# EAGLE design GBA_EMU (EAGLE 7.7.0)
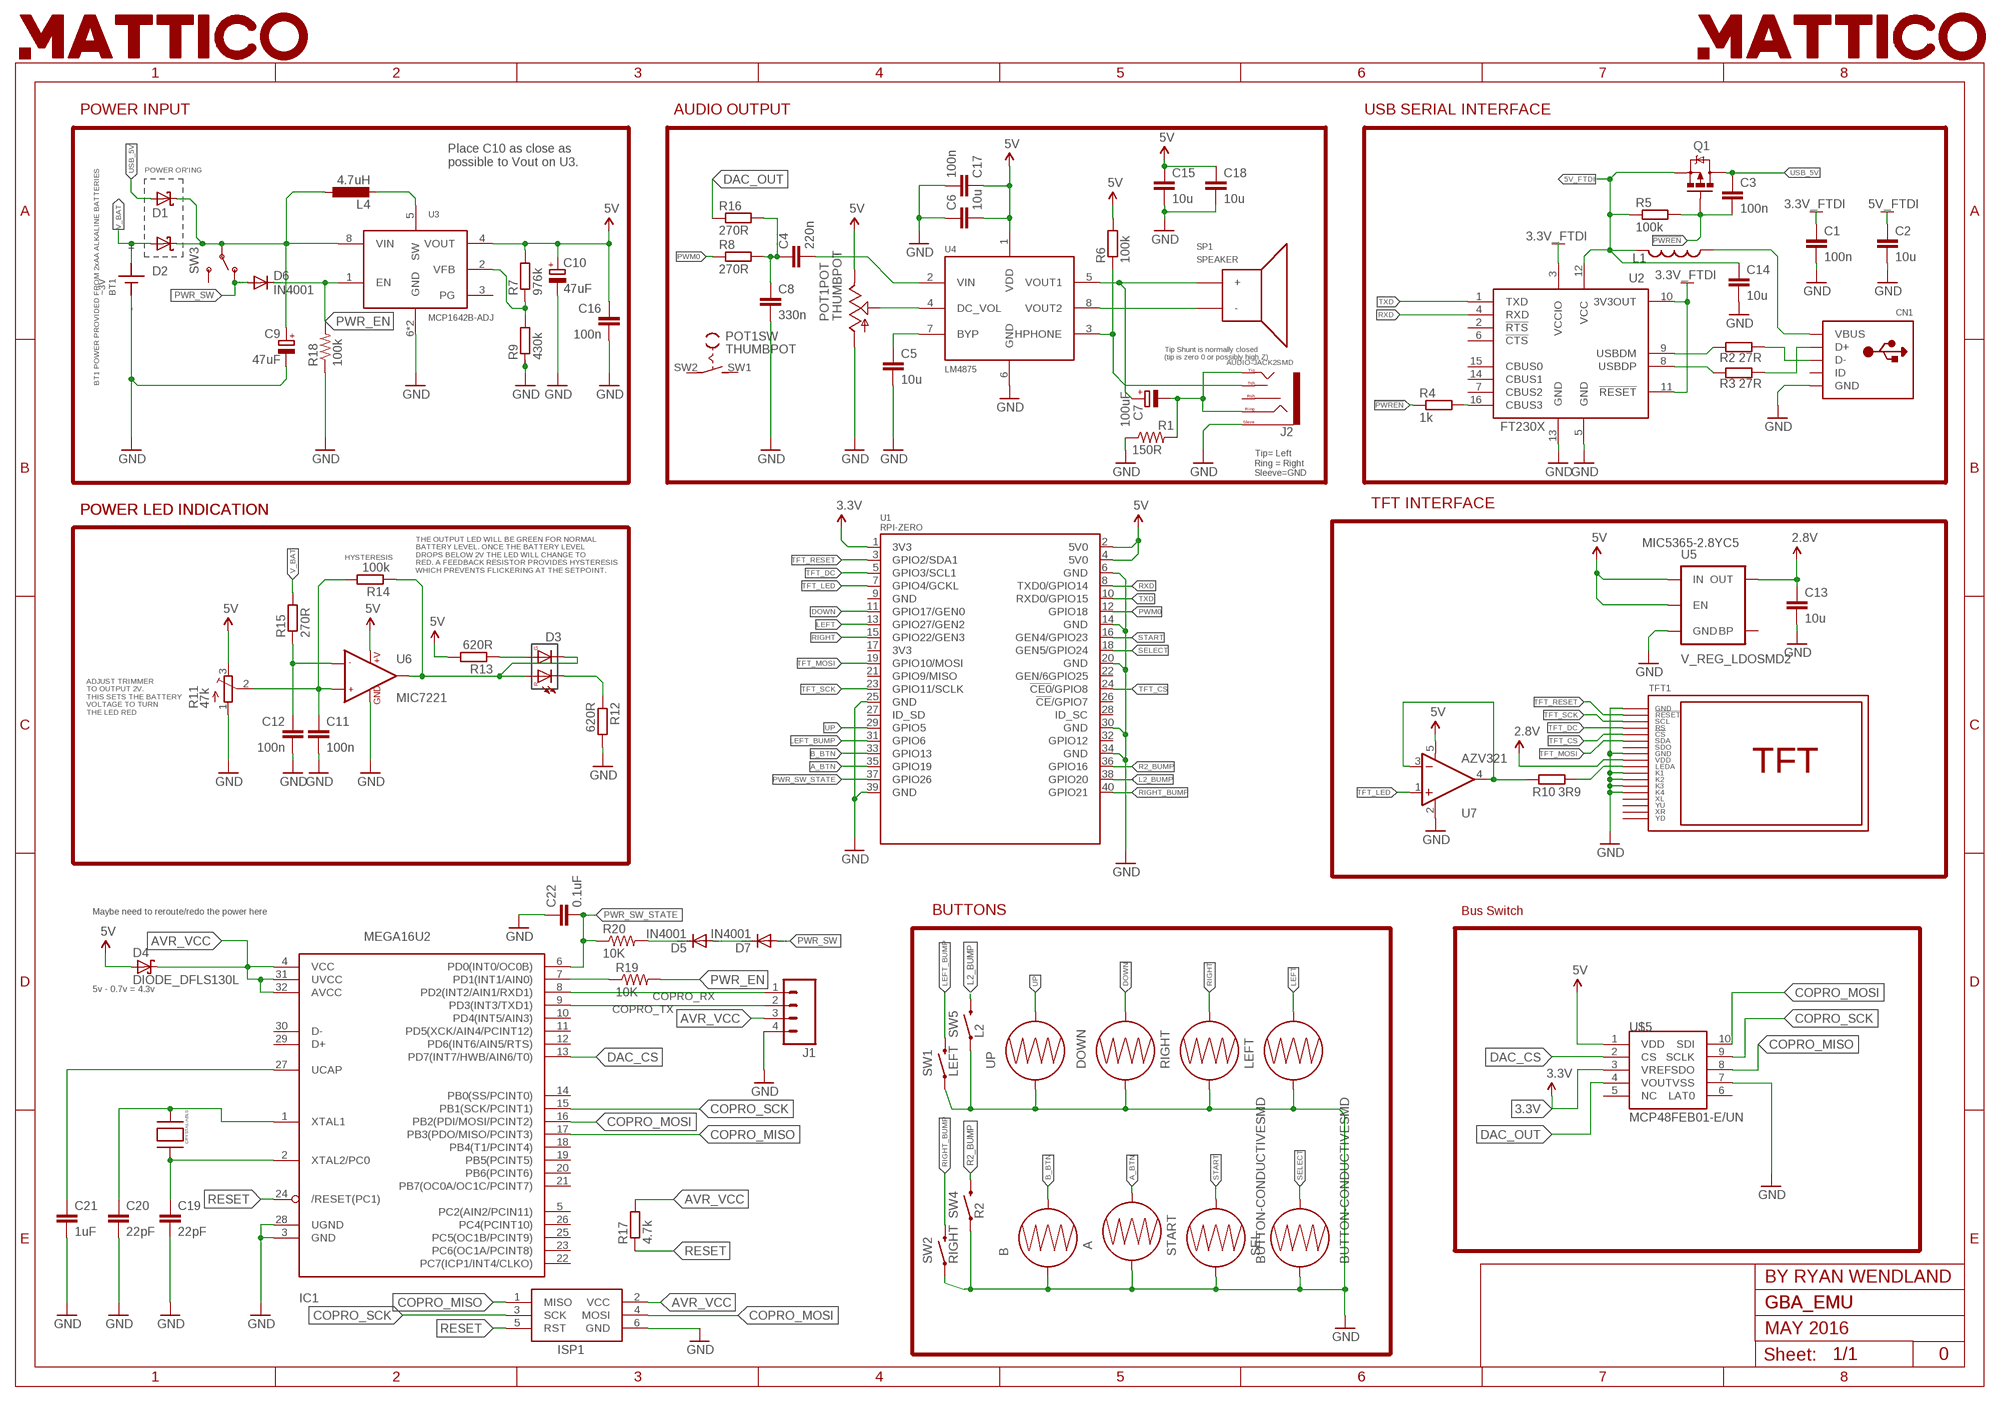
[diagram p0: schematic, sheet 1]

## Parts
A  GBA_BTN_CONDUCTIVE  [GBA_BUTTON_CONDUCTIVE]
B  GBA_BTN_CONDUCTIVE  [GBA_BUTTON_CONDUCTIVE]
BT1  ~3V  BATTERY  [BATTERY]
C1  100n  C-EUC0805  [C0805]
C2  10u  C-EUC0805  [C0805]
C3  100n  C-EUC0805  [C0805]
C4  220n  C-EUC0805  [C0805]
C5  10u  C-EUC0805  [C0805]
C6  10u  C-EUC0805  [C0805]
C7  100uF  CPOL-EU153CLV-0405  [153CLV-0405]
C8  330n  C-EUC0805  [C0805]
C9  47uF  CPOL-EU153CLV-0405  [153CLV-0405]
C10  47uF  CPOL-EU153CLV-0405  [153CLV-0405]
C11  100n  C-EUC0805  [C0805]
C12  100n  C-EUC0805  [C0805]
C13  10u  C-EUC0805  [C0805]
C14  10u  C-EUC0805  [C0805]
C15  10u  C-EUC0805  [C0805]
C16  100n  C-EUC0805  [C0805]
C17  100n  C-EUC0805  [C0805]
C18  10u  C-EUC0805  [C0805]
C19  22pF  22PF-50V-5%(0603)  [0603-CAP]
C20  22pF  22PF-50V-5%(0603)  [0603-CAP]
C21  1uF  1UF-25V-10%(0805)"  [0805-CAP]
C22  0.1uF  0.1UF-25V(+80/-20%)(0603)  [0603-CAP]
CN1  USBMINIB  [USB-MINIB]
D1  DFLS130L  [POWERDI_123]
D2  DFLS130L  [POWERDI_123]
D3  DUAL_LED  [DUAL_LED]
D4  DIODE_DFLS130L  [DIODE_POWERDI_123]
D5  IN4001  CGRM4001-G  [SOD-123_MINI-SMA]
D6  IN4001  CGRM4001-G  [SOD-123_MINI-SMA]
D7  IN4001  CGRM4001-G  [SOD-123_MINI-SMA]
DOWN  GBA_BTN_CONDUCTIVE  [GBA_BUTTON_CONDUCTIVE]
IC1  MEGA16U2  ATMEGA32U2-TQFP  [TQFP32-08]
ISP1  AVRISP-6  [AVRISP]
J1  M041.27MM  [1X04-1.27MM]
J2  AUDIO-JACK2SMD  [AUDIO-JACK-3.5MM-SMD]
L1  600  INDUCTOR0805  [0805]
L4  4.7uH  L-EUWE-TPC  [POWER-CHOKE_WE-TPC]
LEFT  GBA_BTN_CONDUCTIVE  [GBA_BUTTON_CONDUCTIVE]
POT1  THUMBPOT  [THUMBWHEEL]
Q1  MOSFET-PCHANNEL  [SOT23-3]
R1  150R  47KOHM1/10W1%(0603)  [0603-RES]
R2  27R  R-EU_R0805  [R0805]
R3  27R  R-EU_R0805  [R0805]
R4  1k  R-EU_R0805  [R0805]
R5  100k  R-EU_R0805  [R0805]
R6  100k  R-EU_R0805  [R0805]
R7  976k  R-EU_R0805  [R0805]
R8  270R  R-EU_R0805  [R0805]
R9  430k  R-EU_R0805  [R0805]
R10  3R9  R-EU_R0805  [R0805]
R11  47k  TRIMPOTTC33X  [TC33X]
R12  620R  R-EU_R0805  [R0805]
R13  620R  R-EU_R0805  [R0805]
R14  100k  R-EU_R0805  [R0805]
R15  270R  R-EU_R0805  [R0805]
R16  270R  R-EU_R0805  [R0805]
R17  4.7k  R-EU_R0805  [R0805]
R18  100k  100KOHM-1/10W-1%(0603)  [0603-RES]
R19  10K  10KOHM-1/10W-1%(0603)0603  [0603-RES]
R20  10K  10KOHM-1/10W-1%(0603)0603  [0603-RES]
RIGHT  GBA_BTN_CONDUCTIVE  [GBA_BUTTON_CONDUCTIVE]
SEL  BUTTON-CONDUCTIVESMD  [BUTTON-CONDUCTIVE]
SP1  SPEAKER  [SPEAKER]
START  BUTTON-CONDUCTIVESMD  [BUTTON-CONDUCTIVE]
SW1  LEFT  BUTTON  [BUMPER]
SW2  RIGHT  BUTTON  [BUMPER]
SW3  GBA_PWR_SWITCHCSS_1310TB  [PWR_SWITCH_CSS_1310TB]
SW4  R2  GBA_BUTTONNOHOLE  [BUMPER_NOHOLE]
SW5  L2  GBA_BUTTONNOHOLE  [BUMPER_NOHOLE]
TFT1  GBA_TFT  [GBA_TFT]
U1  RPI-ZERO  [RASPBERRYPI_BASTELSTUBE_V13_RASPI_BOARD_B+_FULL]
U2  FT230X  [SSOP16]
U3  MCP1642B-ADJ  [MSOP8]
U4  LM4875  [SOIC8]
U5  V_REG_LDOSMD2  [SC70]
U6  MIC7221  [SOT23-5]
U7  AZV321  [SOT23-5]
U$1  LOGO2INCH_SVG  [LOGO_2INCH_SVG]
U$2  LOGO2INCH_SVG  [LOGO_2INCH_SVG]
U$3  CRYSTAL-ABLS  [HC49/US]
U$5  MCP48FEB01-E/UN  [10-MSOP]
UP  GBA_BTN_CONDUCTIVE  [GBA_BUTTON_CONDUCTIVE]

## Nets
0.8128: C9.+ D1.2(C) D2.2(C) L4.1 SW3.P$3(P) U3.8(VIN)
2.8V: C13.1 TFT1.9(VDD) U5.5(OUT)
3.3V: U1.1(3V3) U$5.3(VREF)
3.3V_FTDI: C1.1 U2.3(VCCIO) U2.10(3V3OUT) U2.11(!RESET)
5V: C6.2 C10.+ C15.1 C16.1 C17.1 C18.1 D4.1(A) POT1.3(POT:E) R6.2 R7.2 R11.3(E) R13.2 U1.2(5V0) U1.4(5V0) U3.4(VOUT) U4.1(VDD) U5.1(IN) U5.3(EN) U6.2(+V) U7.5(V+) U$5.1(VDD)
5V_FTDI: C2.1 C14.1 L1.1 Q1.2(S) R5.1 U2.12(VCC)
!PWREN: C3.2 Q1.1(G) R4.1 R5.2
A_BTN: A.2 U1.35(GPIO19)
AVR_VCC: D4.2(C) IC1.4(VCC) IC1.31(UVCC) IC1.32(AVCC) ISP1.2(VCC) J1.3 R17.2
B_BTN: B.2 U1.33(GPIO13)
COPRO_MISO: IC1.17(PB3(PDO/MISO/PCINT3)) ISP1.1(MISO) U$5.8(SDO)
COPRO_MOSI: IC1.16(PB2(PDI/MOSI/PCINT2)) ISP1.4(MOSI) U$5.10(SDI)
COPRO_RX: IC1.8(PD2(INT2/AIN1/RXD1)) J1.1
COPRO_SCK: IC1.15(PB1(SCK/PCINT1)) ISP1.3(SCK) U$5.9(SCLK)
COPRO_TX: IC1.9(PD3(INT3/TXD1)) J1.2
DAC_CS: IC1.13(PD7(INT7/HWB/AIN6/T0)) U$5.2(CS)
DAC_OUT: R16.1 U$5.4(VOUT)
DOWN: DOWN.2 U1.11(GPIO17/GEN0)
GND: A.1 B.1 BT1.BT-1(-) BT1.BT-2(-) C1.2 C2.2 C5.2 C6.1 C8.2 C9.- C10.- C11.2 C12.2 C13.2 C14.2 C15.2 C16.2 C17.2 C18.2 C19.2 C20.2 C21.2 C22.1 CN1.GND DOWN.1 IC1.3(GND) IC1.28(UGND) ISP1.6(GND) J1.4 J2.SLEEVE LEFT.1 POT1.1(POT:A) R1.1 R9.1 R11.1(A) R12.2 R18.1 RIGHT.1 SEL.1 START.1 SW1.1 SW2.1 SW4.1 SW5.1 TFT1.1(GND) TFT1.8(GND) TFT1.11(K1) TFT1.12(K2) TFT1.13(K3) TFT1.14(K4) U1.6(GND) U1.14(GND) U1.20(GND) U1.25(GND) U1.30(GND) U1.34(GND) U1.39(GND) U2.5(GND) U2.13(GND) U3.6(GND) U3.7(GND) U4.6(GND) U5.2(GND) U6.5(GND) U7.2(V-) U$5.7(VSS) UP.1
L2_BUMP: SW5.2 U1.38(GPIO20)
LEFT: LEFT.2 U1.13(GPIO27/GEN2)
LEFT_BUMP: SW1.2 U1.31(GPIO6)
N$1: C11.1 R11.2(S) R14.2 U6.3(+IN1)
N$2: C4.1 C8.1 R8.2 R16.2
N$3: CN1.VBUS L1.2
N$4: CN1.D- R2.2
N$5: CN1.D+ R3.2
N$6: R2.1 U2.9(USBDM)
N$7: R3.1 U2.8(USBDP)
N$8: POT1.2(POT:S) U4.4(DC_VOL)
N$9: C4.2 U4.2(VIN)
N$10: R4.2 U2.16(CBUS3)
N$11: C5.1 U4.7(BYP)
N$12: L4.2 U3.5(SW)
N$13: D5.A D7.C
N$14: C7.+ SP1.1(+) U4.5(VOUT1)
N$15: SP1.2(-) U4.8(VOUT2)
N$16: J2.TSH R6.1 U4.3(HPHONE)
N$17: C20.1 IC1.1(XTAL1) U$3.P$2
N$18: IC1.7(PD1(INT1/AIN0)) R19.1
N$19: D3.1 D3.3 R14.1 U6.1(OUT1)
N$20: R7.1 R9.2 U3.2(VFB)
N$21: R10.2 TFT1.10(LEDA)
N$22: D3.4 R13.1
N$23: D3.2 R12.1
N$24: R10.1 U7.3(-IN) U7.4(OUT)
N$25: C12.1 R15.1 U6.4(-IN1)
N$26: C19.1 IC1.2(XTAL2/PC0) U$3.P$1
N$28: C21.1 IC1.27(UCAP)
N$29: C7.- J2.RING J2.TIP R1.2
N$31: D5.C R20.2
PWM0: R8.1 U1.12(GPIO18)
PWR_EN: D6.C R18.2 R19.2 U3.1(EN)
PWR_SW: D6.A D7.A SW3.P$1(O)
PWR_SW_STATE: C22.2 IC1.6(PD0(INT0/OC0B)) R20.1 U1.37(GPIO26)
R2_BUMP: SW4.2 U1.36(GPIO16)
RESET: IC1.24(/RESET(PC1)) ISP1.5(RST) R17.1
RIGHT: RIGHT.2 U1.15(GPIO22/GEN3)
RIGHT_BUMP: SW2.2 U1.40(GPIO21)
RXD: U1.8(TXD0/GPIO14) U2.4(RXD)
SELECT: SEL.2 U1.18(GEN5/GPIO24)
START: START.2 U1.16(GEN4/GPIO23)
TFT_CS: TFT1.5(!CS) U1.24(!CE0!/GPIO8)
TFT_DC: TFT1.4(RS) U1.5(GPIO3/SCL1)
TFT_LED: U1.7(GPIO4/GCKL) U7.1(+IN)
TFT_MOSI: TFT1.6(SDA) U1.19(GPIO10/MOSI)
TFT_RESET: TFT1.2(!RESET) U1.3(GPIO2/SDA1)
TFT_SCK: TFT1.3(SCL) U1.23(GPIO11/SCLK)
TXD: U1.10(RXD0/GPIO15) U2.1(TXD)
UP: U1.29(GPIO5) UP.2
USB_5V: C3.1 D1.1(A) Q1.3(D)
V_BAT: BT1.BT+1(+) BT1.BT+2(+) D2.1(A) R15.2
Unconnected: CN1.ID IC1.5(PC2(AIN2/PCIN11)) IC1.10(PD4(INT5/AIN3)) IC1.11(PD5(XCK/AIN4/PCINT12)) IC1.12(PD6(INT6/AIN5/RTS)) IC1.14(PB0(SS/PCINT0)) IC1.18(PB4(T1/PCINT4)) IC1.19(PB5(PCINT5)) IC1.20(PB6(PCINT6)) IC1.21(PB7(OC0A/OC1C/PCINT7)) IC1.22(PC7(ICP1/INT4/CLKO)) IC1.23(PC6(OC1A/PCINT8)) IC1.25(PC5(OC1B/PCINT9)) IC1.26(PC4(PCINT10)) IC1.29(D+) IC1.30(D-) J2.RSH POT1.SW1(SW:S) POT1.SW2(SW:P) SW3.P$4(S) TFT1.7(SDO) TFT1.15(XL) TFT1.16(YU) TFT1.17(XR) TFT1.18(YD) U1.9(GND) U1.17(3V3) U1.21(GPIO9/MISO) U1.22(GEN/6GPIO25) U1.26(!CE!/GPIO7) U1.27(ID_SD) U1.28(ID_SC) U1.32(GPIO12) U2.2(!RTS) U2.6(!CTS) U2.7(CBUS2) U2.14(CBUS1) U2.15(CBUS0) U3.3(PG) U5.4(BP) U$5.5(NC) U$5.6(LAT0)

## Notes on the sheet
- POWER INPUT | AUDIO OUTPUT | USB SERIAL INTERFACE
- Place C10 as close as
  possible to Vout on U3.
- POWER OR'ING
- Tip Shunt is normally closed
  (tip is zero 0 or possibly high Z)
- BT1 POWER PROVIDED FROM 2xAA ALKALINE BATTERIES
- Tip= Left
  Ring = Right
  Sleeve=GND
- TFT INTERFACE
- POWER LED INDICATION | POWER LED INDICATION
- MIC5365-2.8YC5
- HYSTERESIS
- THE OUTPUT LED WILL BE GREEN FOR NORMAL
  BATTERY LEVEL. ONCE THE BATTERY LEVEL
  DROPS BELOW 2V THE LED WILL CHANGE TO
  RED. A FEEDBACK RESISTOR PROVIDES HYSTERESIS
  WHICH PREVENTS FLICKERING AT THE SETPOINT.
- ADJUST TRIMMER
  TO OUTPUT 2V.
  THIS SETS THE BATTERY
  VOLTAGE TO TURN
  THE LED RED
- Maybe need to reroute/redo the power here | BUTTONS | Bus Switch
- 5v - 0.7v = 4.3v
- BY RYAN WENDLAND
- GBA_EMU
- MAY 2016
- 0

## Library data of the parts
A B DOWN LEFT RIGHT UP = GBA:GBA_BTN_CONDUCTIVE
BT1 = GBA:BATTERY
C1-C6 C8 C11-C18 = rcl:C-EU: CAPACITOR, European symbol
C7 C9 C10 = rcl:CPOL-EU: POLARIZED CAPACITOR, European symbol
C19 C20 = SparkFun-Capacitors:22PF-50V-5%(0603): CAP-07876; PROD_ID: CAP-07876
C21 = SparkFun-Capacitors:1UF-25V-10%(0805): CAP-08064
C22 = SparkFun-Capacitors:0.1UF-25V(+80/-20%)(0603): CAP-00810 Ceramic Standard decoupling cap; PROD_ID: CAP-00810
CN1 = adafruit:USB: USB Connectors USBMINIB - Surface Mount Female Mini-B USB Connector 4UConnector: 06564 By microbuilder.eu Thru-hole RA Female Mini-B USB Connector 4UConnector: 18732 By ladyada.net
D1 D2 = diode:DFLS130L
D3 = GBA:DUAL_LED
D4 = custom:DIODE_DFLS130L
D5-D7 = diode:CGRM400*-G: Molded plasitc,JEDEC SOD-123/Mini SMA Source: Comchip CGRM4001-G.pdf
IC1 = adafruit:ATMEGA32U2: ATmega32u2 Pin compatible with the atmega8u2, atmega16u2 and atmega32u2 8, 16 or 32 K flash, 1K RAM, 512b EEPROM 8 bit and 16 bit timer (5 PWM total) UART, SPI (no I2C!) USB with 4 endpoints, LUFA compatible 22 I/O lines, analog comparator (no ADC!) Comes with DFU bootloader burned in!
ISP1 = adafruit:AVRISP: AVR ISP HEADER Standard 6 pin header for AVR programming
J1 = SparkFun-Connectors:M04: Header 4 Standard 4-pin 0.1" header. Use with straight break away headers (SKU : PRT-00116), right angle break away headers (PRT-00553), swiss pins (PRT-00743), machine pins (PRT-00117), and female headers (PRT-00115). Molex polarized connector foot print use with SKU : PRT-08231 with associated crimp pins and housings. 1MM SMD Version SKU: PRT-10208
J2 = SparkFun-Connectors:AUDIO-JACK2: Stereo audio jack with bypass switches. SMT version used on LilyPad MP3 board.; PROD_ID: CONN-10353
L1 = SparkFun-Passives:INDUCTOR: Inductors Basic Inductor/Choke - 0603 and 1206. Footprints are not proven and vary greatly between part numbers. INDUCTOR POWER 3.3UH 4.0A SMD 0.197" L x 0.197" W x 0.177" H (5.00mm x 5.00mm x 4.50mm)
L4 = rcl:L-EU: INDUCTOR, European symbol
POT1 = adafruit:THUMBPOT: Thumbwheel pot with switch Available in horizontal (Alpha RV121SF) or vertical (Xicon 311-1701)
Q1 = SparkFun-DiscreteSemi:MOSFET-PCHANNEL: Generic PMOSFET IRLML2244 - TRANS-11153 (SOT-23 -20V -4.3A) (1.Gate 2.Source 3.Drain) FQP27P06 - COM-10349 <http://www.sparkfun.com/products/10349> (TO-220 -60V -27A) (1.Gate 2.Source 3.Drain); PROD_ID: TRANS-08285
R1 = SparkFun-Resistors:47KOHM1/10W1%(0603): RES-07871; PROD_ID: RES-07871; VALUE: 47K
R2-R10 R12-R17 = rcl:R-EU_: RESISTOR, European symbol
R11 = adafruit:TRIMPOT: SMT trimmer potentiometer part number TC33X http://www.ladyada.net/library/eagle
R18 = SparkFun-Resistors:100KOHM-1/10W-1%(0603): RES-07828; PROD_ID: RES-07828
R19 R20 = SparkFun-Resistors:10KOHM-1/10W-1%(0603): RES-00824; PROD_ID: RES-00824
SEL START = SparkFun-Electromechanical:BUTTON-CONDUCTIVE: Used with rubber key pads. This one was designed and proven to work with the PolyCase Key FOB enclosures.
SP1 = GBA:SPEAKER
SW1 SW2 = GBA:BUTTON
SW3 = custom:GBA_PWR_SWITCH
SW4 SW5 = custom:GBA_BUTTON
TFT1 = GBA:GBA_TFT
U1 = RPI-Zero:RPI-ZERO
U2 = ftdichip:FT230X
U3 = microchip:MCP1642B-ADJ
U4 = texas:LM4875
U5 = SparkFun-PowerIC:V_REG_LDO: Voltage Regulator LDO Standard 150mA LDO voltage regulator in SOT-23 layout. Micrel part MIC5205. BP (by-pass) pin is used to lower output noise with 470pF cap.; PROD_ID: VREG-08428
U6 = SparkFun-AnalogIC:MIC7221
U7 = GBA:AZV321
U$1 U$2 = custom:LOGO
U$3 = custom:CRYSTAL-ABLS: Crystal such as digikey part number 535-13436-1-ND
U$5 = custom:MCP48FEB01-E

## Board
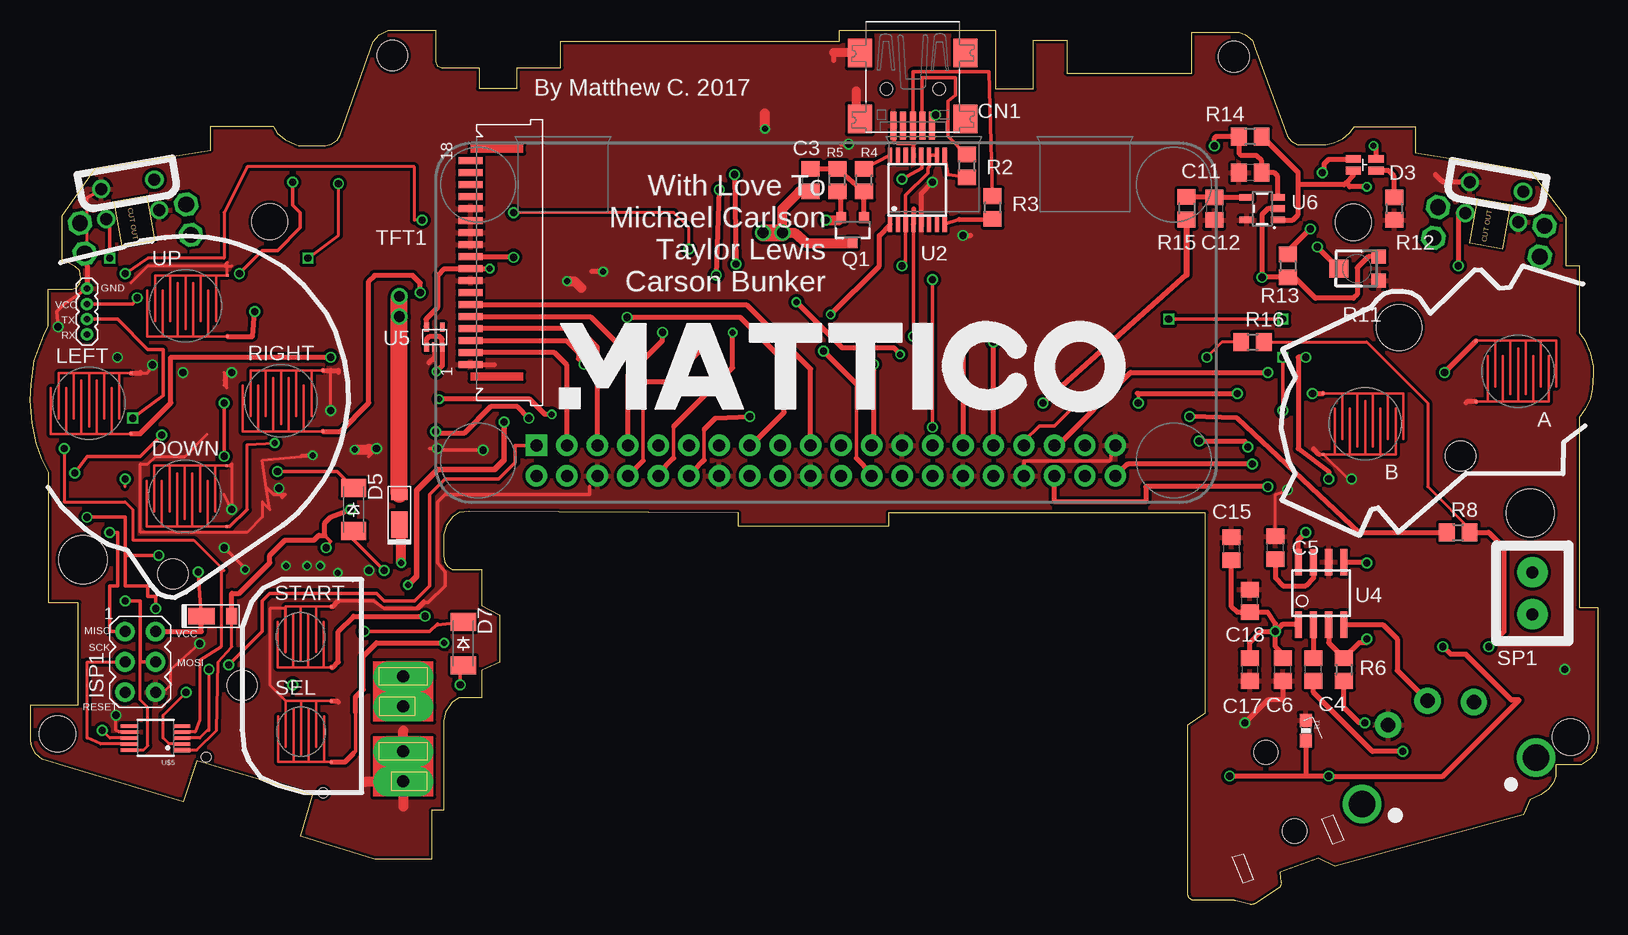
[diagram p1: board, top side]
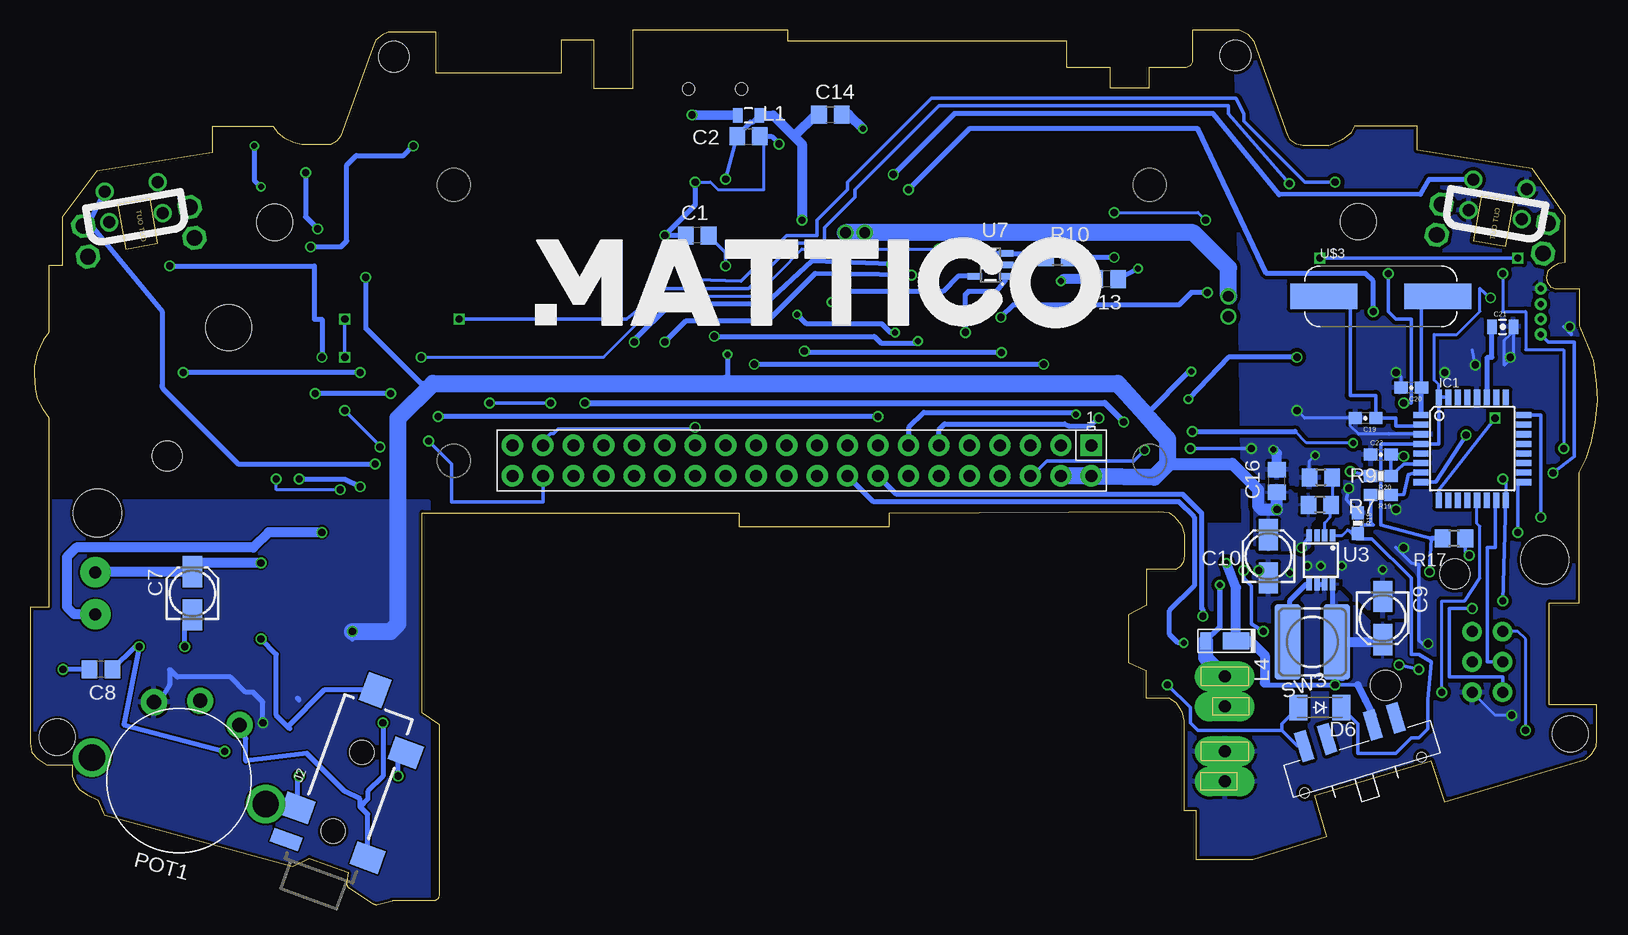
[diagram p2: board, bottom side, seen from below]

Size 130.69 x 72.92 mm. Coordinates in mm from the lower left corner, seen from the top.
Outline: 44.23,72 67.49,72 67.49,72.92 80.47,72.92 80.47,68.02 83.66,68.02 83.66,72.06 86.44,72.06 86.44,69.33 96.85,69.33 96.85,72.72 100.82,72.72 101.3,72.55 101.88,72.06 102.12,71.43 104.81,64.08 105.13,63.65 105.63,63.36 108.03,63.36 108.7,63.53 109.43,63.87 109.99,64.31 110.39,64.87 115.48,64.87 115.48,62.69 125.12,61.16 128,57.31 128,53.27 129.14,53.27 129.14,47.69 129.6,47.09 130.07,45.98 130.33,44.87 130.33,44.25 130.25,43 130.07,42.15 129.64,41.33 129.14,40.6 129.14,24.79 130.69,24.79 130.69,13.46 130.53,12.69 130.04,12.17 129.31,11.66 127.18,11.66 127.18,10.71 126.98,10.16 126.58,9.6 125.93,9.17 125.03,8.75 124.58,7.66 124.5,7.46 108.77,3.2 107.4,3.87 104.17,2.69 104.29,1.85 arc-65 104.06,1.36 102.09,0.08 arc-48 101.69,0.02 100.5,0.33 arc15 100.38,0.34 97.04,0.36 arc-90 96.53,0.86 96.53,14.98 98,15.98 98,32.67 71.58,32.67 71.58,31.52 59.06,31.52 59.06,32.65 36.59,32.78 35.76,32.71 35.27,32.34 34.73,31.65 34.48,30.88 34.48,29.11 34.55,28.57 34.79,28.19 35.17,27.96 37.64,27.96 37.64,24.96 39.13,24.15 39.13,20.18 37.66,19.54 37.66,17.22 35.75,17.22 35.18,16.84 34.65,16.07 34.49,15.31 34.49,7.86 33.49,7.86 33.49,3.79 28.74,3.79 22.58,5.68 23.57,9.1 13.91,11.99 12.78,8.58 1.02,12.09 0.5,12.55 0.14,13.19 0.07,13.63 0.07,16.67 4.04,16.67 4.04,25.16 1.56,25.16 1.56,36.03 0.97,37.18 0.54,38.48 0.19,40.16 0,42.04 0.08,43.4 0.34,45.37 0.72,46.37 1.16,47.43 1.47,48.14 1.51,48.23 1.51,51.3 3.52,51.3 3.89,51.45 4.19,51.84 4.23,52.3 4.14,52.86 3.76,53.2 3.24,53.48 2.71,53.57 2.71,57.43 5.44,61.36 15.06,62.91 15.06,64.9 20.28,64.9 20.6,64.32 21.28,63.8 22.18,63.35 22.4,63.28 24.6,63.28 25.12,63.41 25.61,63.75 25.86,64.14 28.62,71.95 29.12,72.52 29.87,72.91 33.8,72.91 33.8,70.26 33.95,69.93 34.31,69.76 37.44,69.76 37.44,68.06 40.62,68.06 40.62,69.78 44.24,69.78 44.23,72
Copper layers (1*16): Top 0.035mm / dielectric 1.5mm / Bottom 0.035mm
Design rules "Elecrow_2-layer_eagle_rule": minimum track width 6mil, minimum drill 12mil, track to track 6mil, track to pad 6mil, pad to pad 6mil, via to via 6mil, smd to smd 0mil, copper to edge 10mil, drill to drill 10mil, minimum pad ring 10mil, minimum via ring 6mil, stop-mask expansion 2mil, vias tented up to drill 100mil, thermal gap 10mil
Holes 3 mm at 2.29,14.23 19.97,56.94 110.31,56.88 128.41,13.96
Holes 2.54 mm at 30.21,70.79 100.36,70.69
Holes 2.5 mm at 17.7,18.27 11.92,27.56 119.26,37.4
Holes 3.8 mm at 114.13,48.12
Holes 4 mm at 125.06,32.65 4.41,28.76

### Footprints (pad centres in the part's own frame; a part is rotated, then mirrored left to right if it is on the bottom)
GBA_BUTTON_CONDUCTIVE = smd 0.203 x 0.203: 1 3.493,2.54; 2 3.493,-2.54
BATTERY = drill 1 pad 2.5 long: BT+1 0,4.5; BT+2 0,2; BT-1 0,-1.75; BT-2 0,-4.25
C0805 = smd 1.3 x 1.5: 1 -0.95,0; 2 0.95,0
153CLV-0405 = smd 2.6 x 1.6: + 1.8,0; - -1.8,0
0603-CAP = smd 1.1 x 1: 1 -0.85,0; 2 0.85,0
0805-CAP = smd 0.8 x 1.2: 1 -0.9,0; 2 0.9,0
USB-MINIB = smd 0.5 x 2.308: D+ 0,4.064; D- -0.8,4.064; GND 1.6,4.064; ID 0.8,4.064; VBUS -1.6,4.064 | smd 2 x 2.4: GND1 -4.4,-2; GND2 -4.4,3.5; GND3 4.4,3.5; GND4 4.4,-2 | hole 1: -2.2,1; 2.2,1
POWERDI_123 = smd 0.9 x 1.4: 1 2.54,0 | smd 2.2 x 1.4: 2 0,0
DUAL_LED = smd 1.27 x 0.635: 1 0.953,0.492; 2 -0.953,0.492; 3 -0.953,-0.492; 4 0.953,-0.492
DIODE_POWERDI_123 = smd 0.9 x 1.4: 1 2.54,0 | smd 2.2 x 1.4: 2 0,0
SOD-123_MINI-SMA = smd 1.5 x 2.1: A 1.8,0; C -1.8,0
TQFP32-08 = smd 1.27 x 0.508: 1 -4.293,2.8; 2 -4.293,2; 3 -4.293,1.2; 4 -4.293,0.4; 5 -4.293,-0.4; 6 -4.293,-1.2; 7 -4.293,-2; 8 -4.293,-2.8; 17 4.293,-2.8; 18 4.293,-2; 19 4.293,-1.2; 20 4.293,-0.4; 21 4.293,0.4; 22 4.293,1.2; 23 4.293,2; 24 4.293,2.8 | smd 0.508 x 1.27: 9 -2.8,-4.293; 10 -2,-4.293; 11 -1.2,-4.293; 12 -0.4,-4.293; 13 0.4,-4.293; 14 1.2,-4.293; 15 2,-4.293; 16 2.8,-4.293; 25 2.8,4.293; 26 2,4.293; 27 1.2,4.293; 28 0.4,4.293; 29 -0.4,4.293; 30 -1.2,4.293; 31 -2,4.293; 32 -2.8,4.293
AVRISP = drill 0.9 pad 1.626: 1 -1.27,2.54; 2 1.27,2.54; 3 -1.27,0; 4 1.27,0; 5 -1.27,-2.54; 6 1.27,-2.54
1X04-1.27MM = drill 0.508 pad 1: 1 0,0; 2 1.27,0; 3 2.54,0; 4 3.81,0
AUDIO-JACK-3.5MM-SMD = smd 2 x 2.5: RING 4.3,3.45; SLEEVE 2.4,-3.45; TIP 11.7,-3.45 | smd 1.2 x 2.5: RSH 1.5,3.45 | smd 2.5 x 2: TSH 15.75,0.75 | hole 2: 3.5,0; 10.5,0
0805 = smd 0.8 x 1.2: 1 -0.9,0; 2 0.9,0
POWER-CHOKE_WE-TPC = smd 6.3 x 2.2: 1 0,2.05; 2 0,-2.05
THUMBWHEEL = drill 1.2 pad 2.184: 1 -3.7,-5.8; 2 0,-6.9; 3 3.7,-5.8 | drill 2.2: SW1 -7.5,0; SW2 7.5,0
SOT23-3 = smd 0.8 x 0.9: 1 -0.95,-1; 2 0.95,-1; 3 0,1.1
0603-RES = smd 1.1 x 1: 1 -0.85,0; 2 0.85,0
R0805 = smd 1.3 x 1.5: 1 -0.95,0; 2 0.95,0
TC33X = smd 1.2 x 1.2: 1 -1,-1.825; 3 1,-1.825 | smd 1.5 x 1.6: 2 0,1.5
BUTTON-CONDUCTIVE = smd 0.203 x 0.203: 1 2.54,2.54; 2 2.54,-2.54
SPEAKER = drill 1 pad 2.54: 1 -1.75,0; 2 1.75,0
BUMPER = drill 1: 1 -2.25,1.5; 2 2.25,1.5 | drill 1.3 octagon: NC1 -4.5,-1; NC2 4.5,-1
PWR_SWITCH_CSS_1310TB = smd 1 x 2.5: P$1 1.1,3.75; P$2 3.1,3.75; P$3 7.1,3.75; P$4 9.1,3.75 | hole 0.8: 0,0; 10.2,0
BUMPER_NOHOLE = drill 1: 1 -2.25,1.5; 2 2.25,1.5 | drill 1.3 octagon: NC1 -4.5,-1; NC2 4.5,-1
GBA_TFT = smd 0.6 x 2: 1 -9,2; 2 -8,2; 3 -7,2; 4 -6,2; 5 -5,2; 6 -4,2; 7 -3,2; 8 -2,2; 9 -1,2; 10 0,2; 11 1,2; 12 2,2; 13 3,2; 14 4,2; 15 5,2; 16 6,2; 17 7,2; 18 8,2
RASPBERRYPI_BASTELSTUBE_V13_RASPI_BOARD_B+_FULL = drill 1 pad 1.778 square: 1 8.37,25.23 | drill 1 pad 1.778: 2 8.37,27.77; 3 10.91,25.23; 4 10.91,27.77; 5 13.45,25.23; 6 13.45,27.77; 7 15.99,25.23; 8 15.99,27.77; 9 18.53,25.23; 10 18.53,27.77; 11 21.07,25.23; 12 21.07,27.77; 13 23.61,25.23; 14 23.61,27.77; 15 26.15,25.23; 16 26.15,27.77; 17 28.69,25.23; 18 28.69,27.77; 19 31.23,25.23; 20 31.23,27.77; 21 33.77,25.23; 22 33.77,27.77; 23 36.31,25.23; 24 36.31,27.77; 25 38.85,25.23; 26 38.85,27.77; 27 41.39,25.23; 28 41.39,27.77; 29 43.93,25.23; 30 43.93,27.77; 31 46.47,25.23; 32 46.47,27.77; 33 49.01,25.23; 34 49.01,27.77; 35 51.55,25.23; 36 51.55,27.77; 37 54.09,25.23; 38 54.09,27.77; 39 56.63,25.23; 40 56.63,27.77
SSOP16 = smd 1.3 x 0.35: 1 -2.875,2.275; 2 -2.875,1.625; 3 -2.875,0.975; 4 -2.875,0.325; 5 -2.875,-0.325; 6 -2.875,-0.975; 7 -2.875,-1.625; 8 -2.875,-2.275; 9 2.875,-2.275; 10 2.875,-1.625; 11 2.875,-0.975; 12 2.875,-0.325; 13 2.875,0.325; 14 2.875,0.975; 15 2.875,1.625; 16 2.875,2.275
MSOP8 = smd 0.45 x 1: 1 -0.975,-2.05; 2 -0.325,-2.05; 3 0.325,-2.05; 4 0.975,-2.05; 5 0.975,2.05; 6 0.325,2.05; 7 -0.325,2.05; 8 -0.975,2.05
SOIC8 = smd 0.6 x 2.2: 1 -1.905,-2.6; 2 -0.635,-2.6; 3 0.635,-2.6; 4 1.905,-2.6; 5 1.905,2.6; 6 0.635,2.6; 7 -0.635,2.6; 8 -1.905,2.6
SC70 = smd 0.4 x 0.75: 1 -0.65,-0.825; 2 0,-0.825; 3 0.65,-0.825; 4 0.65,0.825; 5 -0.65,0.825
SOT23-5 = smd 0.55 x 1.2: 1 -0.95,-1.3; 2 0,-1.3; 3 0.95,-1.3; 4 0.95,1.3; 5 -0.95,1.3
SOT23-5' = smd 1.2 x 0.55: 1 -1.3,0.95; 2 -1.3,0; 3 -1.3,-0.95; 4 1.3,-0.95; 5 1.3,0.95
HC49/US = smd 5.588 x 2.108: P$1 -4.75,0; P$2 4.75,0
10-MSOP = smd 1.4 x 0.3: 1 -2.2,1; 2 -2.2,0.5; 3 -2.2,0; 4 -2.2,-0.5; 5 -2.2,-1; 6 2.2,-1; 7 2.2,-0.5; 8 2.2,0; 9 2.2,0.5; 10 2.2,1

### Placement (x,y rotation side)
A  124.05,44.47 180 top
B  111.3,40.09 180 top
BT1  31.11,14.52 0 top
C1  75.08,55.8 180 bottom
C2  70.79,64.05 0 bottom
C3  65.08,60.4 90 top
C4  106.99,19.6 90 top
C5  103.81,29.76 90 top
C6  104.45,19.6 90 top
C7  117.15,25.95 90 bottom
C8  124.77,19.6 180 bottom
C9  17.93,23.89 270 bottom
C10  27.45,29.05 90 bottom
C11  101.72,61.03 180 top
C12  98.72,58.03 270 top
C13  40.95,52.14 180 bottom
C14  63.97,65.88 0 bottom
C15  100.16,29.68 90 top
C16  26.74,35.32 90 bottom
C17  101.67,19.6 270 top
C18  101.67,25.32 90 top
C19  19.36,40.56 180 bottom
C20  15.55,43.1 180 bottom
C21  7.93,48.18 0 bottom
C22  18.09,37.51 0 bottom
CN1  73.59,69 180 top
D1  30.79,31.67 90 top
D2  30.15,21.98 180 bottom
D3  111.26,61.69 180 top
D4  14.28,24.05 0 top
D5  26.98,32.94 270 top
D6  23.17,16.43 180 bottom
D7  36.12,21.76 270 top
DOWN  12.9,34.05 0 top
IC1  10.47,38.02 0 bottom
ISP1  9.2,20.24 0 top
J1  4.75,47.54 90 top
J2  106.61,2.84 70 bottom
L1  70.79,65.8 180 bottom
L4  23.8,21.9 270 bottom
LEFT  4.92,41.78 0 top
POT1  118.29,10.33 165 bottom
Q1  68.57,56.27 180 top
R1  106.35,14.52 270 top
R2  78.1,61.59 90 top
R3  80.25,58.12 90 top
R4  69.52,60.4 90 top
R5  67.3,60.4 90 top
R6  109.53,19.6 270 top
R7  23.17,33.33 180 bottom
R8  119.05,31.03 0 top
R9  23.09,35.63 0 bottom
R10  45.05,53.99 0 bottom
R11  110.61,53.03 90 top
R12  113.72,58.03 270 top
R13  104.86,53.26 270 top
R14  101.72,64.03 180 top
R15  96.42,58.06 270 top
R16  101.91,46.91 0 top
R17  11.99,30.52 180 bottom
R18  19.99,31.79 270 bottom
R19  18.09,34.15 180 bottom
R20  18.09,35.73 180 bottom
RIGHT  20.92,41.99 0 top
SEL  22.6,14.43 0 top
SP1  125.24,25.95 270 top
START  22.57,22.32 0 top
SW1  8.42,58.58 10 top
SW2  121.99,58.36 350 top
SW3  24.44,9.31 17 bottom
SW4  121.59,55.8 10 bottom
SW5  8.82,56.05 350 bottom
TFT1  38.72,54.03 90 top
U1  33.85,63.52 180 bottom
U2  73.97,59.61 90 top
U3  23.09,28.73 180 bottom
U4  107.62,25.95 0 top
U5  33.72,47.31 0 top
U6  102.72,58.03 90 top
U7  AZV321  [SOT23-5']  50.63,53.33 180 bottom
U$1  43.49,40.56 0 top
U$2  89.21,47.54 0 bottom
U$3  18.09,50.72 0 bottom
U$5  10.47,13.89 180 top
UP  12.96,49.91 0 top

### Tracks (layer width: path | path; a pad name or v marks a point on that pad's centre or on a via)
0.8128  (via drill 0.5, 0.6)
  Top 0.813: v30.95,28.49 30.95,31.51 D1.2
  Bottom 0.254: 21.87,19.62 21.9,19.6 v21.9,18.33 21.75,18.48 L4.1
  Bottom 0.305: SW3.P$3 18.74,15.81 | 19.99,18.33 v21.9,18.33
  Bottom 0.406: U3.8 22.11,21.79 L4.1 21.75,18.33 v21.9,18.33 27.61,18.33 27.61,20.79 27.77,20.79
  Bottom 0.635: 18.74,15.81 19.36,17.06 19.99,18.33
  Bottom 0.813: 22.11,21.79 22.11,19.86 21.87,19.62 21.31,19.06 | v30.95,28.49 30.15,26.43 D2.2 28.96,21.98 27.77,20.79 27.77,18.49 | L4.1 18.11,21.9 C9.+
  pour Bottom (isolate 0.152): 16.34,18.25 15.47,18.17 15.39,23.41 18.88,23.49 21.66,26.27 21.66,26.9 21.82,27.06 22.22,27.06 22.22,25.39 22.77,24.84 22.77,18.33 18.96,18.33 17.14,17.77
2.8V  (via drill 0.5)
  Top 0.406: U5.5 33.01,48.19 33.01,48.81 33.96,49.76 33.96,52.46 34.53,53.03 TFT1.9 v38.32,53.03
  Bottom 0.406: v38.32,53.03 C13.1
3.3V  (via drill 0.6)
  Top 0.254: v14.91,19.6 14.91,14.52 14.79,14.52 14.15,13.89 U$5.3
  Top 0.305: U1.1 40.44,38.29 40.44,36.87 39.04,35.48 34.6,35.48 33.33,34.21 33.33,26.59 32.06,25.32 29.52,25.32 28.88,25.95 19.99,25.95 19.36,25.32 19.36,22.78 v16.56,19.98
  Bottom 0.305: v16.56,19.98 v14.91,19.6
3.3V_FTDI  (via drill 0.6)
  Top 0.305: v72.7,53.26 72.99,53.55 U2.3 72.99,59.14 74.86,61 74.86,61.38 74.98,61.51 74.98,62.44 U2.11 U2.10
  Bottom 0.305: v72.7,53.26 72.7,54.36 C1.1
5V  (via drill 0.5, 0.6)
  Top 0.254: U$5.1 13.91,12.89 15.55,14.52 15.67,20.24 16.82,21.51 D4.1
  Top 0.305: v24.69,29.76 25.07,30.29 24.58,30.78
  Top 0.406: U4.1 104.39,23.35 v103.81,22.78 | C6.2 104.77,20.55 103.81,21.51 v103.81,22.78 | v111.27,15.16 110.8,15.16 109.53,16.43 R6.2 | U6.2 103.19,58.03 102.7,57.54 v102.7,52.3 102.72,52.31 R13.2 105.39,52.31 107.15,50.56 110.32,50.56 110.64,50.87 110.64,53.1 111.57,54.03 R11.3 | v63.89,50.24 67.7,46.43 71.98,46.43 v72.54,45.87 | U5.1 33.07,47.15 33.31,47.4 34.11,47.4 34.37,47.14 U5.3 34.37,44.93 v33.88,44.44 | C17.1 101.67,21.82 102.62,22.78 v103.81,22.78 | v103.81,22.78 103.81,23.41 103.18,24.36 C18.1 100.64,24.37 100.16,24.84 C15.1 | D4.1 16.82,25.95 17.45,25.95 19.99,28.49 19.99,29.13 21.26,30.4 23.68,30.4 U3.4 24.58,30.78 24.58,31.81 25.07,32.3 v26.74,32.94
  Bottom 0.254: 24.06,33.28 R7.2
  Bottom 0.305: U3.4 v24.69,29.76
  Bottom 0.406: v103.81,22.78 103.81,22.14 | 108.42,17.22 108.26,17.06 | v102.7,52.3 102.7,48.06 98.1,43.46 97.1,43.46 | 27.39,30.78 C10.+ | U7.5 53.33,52.38 54.6,51.11 63.01,51.11 v63.89,50.24 | v72.54,45.87 72.54,43.62 72.7,43.46 | v33.88,44.44 34.08,44.44 37.69,40.84 | v111.27,15.16 111.27,16.9 112.07,17.7 112.7,17.7 113.97,18.97 118.42,18.97 119.05,19.6 119.05,18.33 120.19,16.43 POT1.3
  Bottom 1.016: 35.87,36.75 30.47,36.75 28.33,34.6 28.33,33.25 28.01,32.94 v26.74,32.94 C16.1
  Bottom 1.422: U1.4 U1.2 36.98,35.64 35.87,36.75 35.87,38.81 36.83,39.88 37.46,40.59 37.69,40.84 40.04,43.46 72.7,43.46 97.1,43.46 100,40.56 100,23.41 100.64,22.78 v103.81,22.78
  pour Bottom: 97.46,-1.99 97.46,33.57 133.02,33.57 133.02,-1.99
  pour Bottom: 23.96,30.47 23.96,31.82 23.56,32.22 23.56,34.21 25.31,34.21 26.1,35 28.64,35 28.64,30 28.25,29.6 24.28,29.6 23.96,29.92
5V_FTDI  (via drill 0.6)
  Top 0.305: U2.12 74.35,61.38 v72.7,60.49
  Top 0.406: Q1.2 67.62,59.13 R5.1
  Top 0.813: v66.35,57.07 67.41,57.07 Q1.2
  Bottom 0.305: v72.7,60.49 C2.1
  Bottom 0.406: L1.1 70.45,65.24 70.63,65.24 71.74,64.13 C2.1
  Bottom 0.813: L1.1 68.73,65.8 66.98,64.05 | 66.98,64.05 66.35,63.42 v66.35,57.07 | C14.1 65.16,65.88 66.98,64.05
!PWREN
  Top 0.406: Q1.1 R4.1 R5.2 C3.2
A_BTN  (via drill 0.6)
  Top 0.406: U1.35 85.67,38.29 91.75,44.37 v103.18,44.37 | v117.91,44.37 A.2
  Bottom 0.406: v103.18,44.37 v117.91,44.37
AVR_VCC  (via drill 0.6)
  Top 0.305: D4.2 v14.02,27.73 | J1.3 8.56,50.08 v8.94,50.59
  Top 0.406: ISP1.2 14.28,22.78 D4.2
  Bottom 0.254: IC1.32 13.27,43.36 13.64,43.73 13.64,47.54 11.74,47.54 9.83,49.45 9.83,51.35
  Bottom 0.279: 18.09,31.67 18.09,38.4
  Bottom 0.305: IC1.31 IC1.32 13.27,38.42 IC1.4 14.76,38.4 18.09,38.4 | v14.02,27.73 13.9,30.52 18.09,31.67 | v8.94,50.59 9.83,51.35
  Bottom 0.406: R17.2 13.9,30.52
B_BTN  (via drill 0.6)
  Top 0.305: U1.33 82.86,38.65 84.13,39.92 85.4,39.92 v87.3,41.83 | v92.38,41.83 92.38,42.63
  Top 0.406: 92.28,42.63 92.38,42.63 v100.64,42.63 v100.64,42.62 | v106.91,42.62 B.2
  Bottom 0.305: v87.3,41.83 v92.38,41.83
  Bottom 0.406: v100.64,42.62 v106.91,42.62
COPRO_MISO  (via drill 0.6)
  Top 0.254: U$5.8 6.66,13.89 v6.02,14.52
  Top 0.305: v6.66,31.03 7.29,31.03 7.29,26.59 6.66,26.59 6.66,22.78 ISP1.1
  Bottom 0.254: v6.02,14.52 6.02,22.14 6.66,22.78 ISP1.1
  Bottom 0.305: IC1.17 6.66,35.22 v6.66,31.03
COPRO_MOSI  (via drill 0.6)
  Top 0.254: 7.93,34.84 v7.93,35.48 | U$5.10 9.47,12.89 9.83,13.25 9.83,16.43 9.2,17.06 9.2,20.24
  Top 0.305: v7.93,25.32 9.2,25.32 9.2,20.24 ISP1.4
  Bottom 0.254: v7.93,35.48 7.67,35.48 IC1.16
  Bottom 0.305: IC1.16 v7.93,25.32
COPRO_RX  (via drill 0.6)
  Top 0.305: v10.98,39.16 9.2,37.38 4.75,37.38 v3.74,35.98
  Bottom 0.305: IC1.8 13.77,35.22 13.52,35.22 v10.98,39.16 | v3.74,35.98 1.96,37.38 1.96,46.91 4.12,46.91 J1.1
COPRO_SCK
  Top 0.254: U$5.9 5.89,13.39 4.75,13.89 4.75,20.24 ISP1.3
  Bottom 0.305: IC1.15 8.56,33.72 8.56,29.76 9.2,29.76 9.2,20.24 ISP1.3
COPRO_TX  (via drill 0.6)
  Top 0.305: v8.56,40.56 11.1,42.46 11.1,46.27 9.83,46.27 7.29,48.81 J1.2
  Bottom 0.305: IC1.9 13.26,34.59 v8.56,40.56
DAC_CS  (via drill 0.6)
  Top 0.254: U$5.2 11.6,13.39 11.1,13.89 11.1,15.79 v13.01,17.7
  Bottom 0.254: v13.01,17.7 13.01,25.32 11.1,25.32 9.83,27.22 9.83,31.54 10.09,31.79 10.09,33.7 IC1.13
DAC_OUT  (via drill 0.6)
  Top 0.254: R16.1 99.37,46.91 v98.1,45.64 | v54.92,54.65 54.92,56.43 53.65,57.7 v40.31,57.7 | v32.69,57.07 32.06,57.07 32.06,61.51 18.09,61.51 16.18,57.7 16.18,53.89 9.83,53.89 v7.93,52.62 | v2.85,38.02 2.85,33.57 7.93,33.57 8.56,32.94 8.56,30.4 13.64,30.4 16.18,27.86 16.06,27.86 15.93,27.73 15.93,21.51 14.15,20.36 14.15,15.41 13.77,14.39 U$5.4
  Bottom 0.254: v98.1,45.64 82.86,45.64 77.78,50.72 70.16,50.72 66.35,54.65 v54.92,54.65 | v40.31,57.7 33.33,57.7 v32.69,57.07 | v7.93,52.62 7.93,49.45 6.02,49.45 6.02,46.27 2.85,46.27 v2.85,38.02
DOWN  (via drill 0.5, 0.6)
  Top 0.254: 18.09,32.94 18.09,38.35 v20.39,38.49
  Top 0.305: DOWN.2 16.67,31.51 18.09,32.94
  Top 0.406: v41.58,40.56 40.63,41.51 38.41,41.51 36.19,39.29 33.96,39.29 v33.8,39.44
  Bottom 0.254: v20.39,38.49 24.28,38.49 25.23,39.44
  Bottom 0.406: U1.11 54.92,39.6 54.44,40.08 44.44,40.08 44.12,39.92 42.38,39.92 v41.58,40.56 | v33.8,39.44 25.23,39.44
GND  (via drill 0.5, 0.6)
  Top 0.254: 22.53,37.38 22.61,37.46 v23.56,37.46 19.36,37.06 19.71,34.8 19.99,32.94 19.36,33.57 19.36,32.3 18.09,31.03 9.2,31.03 9.2,36.75 9.83,36.75 10.47,37.38 12.93,37.38 IC1.3 | UP.1 16.46,53.53 16.18,53.26 | 16.18,53.26 9.83,53.26 8.41,51.83 | 4.75,53.26 4.75,58.95 SW1.1 | C20.2 | v25.07,41.19 25.07,44.53 | 16.18,53.26 16.82,53.26 | U$5.7 7.43,14.39 7.17,14.52 v7.17,15.79 | 16.18,34.21 v16.82,32.94 16.82,36.75 16.67,36.59 DOWN.1 | 9.2,44.32 9.79,44.32 v10.21,45 | C20.2 16.4,44.15 | 16.4,44.15 16.18,44.37 16.18,43.31 C20.2 | 16.4,44.15 16.61,44.37 16.82,44.62 16.18,43.73 | 73.71,63.42 72.32,63.42 72.06,63.67 | 21.3,21.05 21.3,24.65 21.26,24.68 19.99,24.68 19.99,18.31 21.33,16.97 | ISP1.6 11.1,17.7 11.74,18.33 11.74,19.6 v14.15,21.76 | C5.2 103.81,34.21 v104.83,34.59 | v110.16,35.48 109.88,35.48 B.1
  Top 0.305: B.1 107.46,37.55 | U2.13 73.64,63.34 73.71,63.42 | 72.06,63.67 72.06,64.86 CN1.GND | 32.18,24.68 29.52,24.68 28.63,25.32 25.71,25.32 | 32.18,24.68 32.82,25.32 | 28.25,37.38 v28.88,38.02 | 33.33,38.02 v33.96,38.02 34.09,37.89 v37.77,37.89 | 32.18,24.68 32.44,24.68 32.95,25.19 33.2,25.19 34.6,26.59 34.6,27.73 33.96,28.49 33.96,33.57 34.6,34.21 46.66,34.21 46.66,34.84 | v20.75,34.71 21.01,33.95 21.26,34.21 20.3,34.21 19.71,34.8 | v17.93,27.93 17.93,28.01 v16.18,29.76 | U1.34 82.86,37 89.97,37 90.1,37.13 90.1,37.9 U1.39 | J1.4 2.85,50.08 2.21,49.45 v2.34,48.18
  Top 0.406: v68.25,63.42 67.62,63.42 | v77.78,55.8 78.41,55.8 | v75.24,60.24 74.29,59.3 U2.5 74.28,58.01 74.28,58.18 | TFT1.1 38.72,45.03 | LEFT.1 9.2,44.32 9.2,44.37 | RIGHT.1 25.07,44.53 25.71,44.53 25.71,44.37 | 107.46,37.55 106.99,38.02 | A.1 119.79,41.93 119.69,41.83 | START.1 25.25,24.86 25.71,25.32 | SEL.1 25.64,16.97 25.71,16.9 | SW2.1 118.01,60.23 arc-45 117.65,60.37 117.15,60.88 | v47.77,52.78 46.82,52.78 | U5.2 33.72,45.63 33.25,45.16 | 66.98,71.04 66.98,70.4 | 4.75,53.26 J1.4 | C6.1 104.45,17.06 103.18,17.06 v101.27,15.16
  Top 0.762: 68.89,71.04 66.98,71.04 | 68.89,65.96 68.89,67.86
  Top 0.813: 31.26,10.23 30.79,10.23 | 30.79,10.23 27.93,10.23 | 31.11,10.08 31.11,8.17 | 31.11,14.52 BT1.BT-1 31.11,12.62 | BT1.BT-2 30.82,10.27 30.79,10.23 | v27.06,37.94 28.17,37.94 28.25,38.02 | v61.27,64.69 61.27,65.96 | v44.76,51.99 45.39,51.99 45.95,51.43
  Bottom 0.152: 23.33,26.68 23.17,26.59 23.17,26.68
  Bottom 0.254: R9.1 24.04,36.99 v23.56,37.46 | C21.2 7.03,45.7 7.78,44.95 7.78,47.06 7.29,47.54 | IC1.3 17.38,39.22 | 17.38,39.22 17.45,39.29 | 17.38,39.22 19.92,39.22 20.63,39.92 20.63,40.56 24.44,40.56 v25.07,41.19 | v7.17,15.79 8.56,15.79 ISP1.6 | v10.21,45 10.47,46.27 | C20.2 16.4,43.95 16.82,44.62 | 12.96,44.32 v12.75,44.37 | v14.15,21.76 14.28,21.51 | 17.45,24.68 17.45,25.21 C9.- | v104.83,34.59 110.16,34.59 v110.16,35.48 | v75.24,60.24 73.97,60.24 73.33,59.61 69.52,59.61 69.52,63.73 C2.2
  Bottom 0.305: C10.- 27.64,27.25 v28.25,27.86 | v28.88,38.02 v33.96,38.02 | v37.77,37.89 38.66,37 45.9,37 47.15,35.75 U1.6 47.3,35.48 | 14.28,21.51 14.91,22.01 14.91,28.36 15.55,28.49 16.82,29.76 | R18.1 20.97,33.79 v20.75,34.71 | v2.34,48.18 2.21,47.54 2.85,48.18
  Bottom 0.406: C2.2 68.89,64.05 v68.25,63.42 | C1.2 v77.78,55.8 75.24,58.34 v75.24,60.24 | C8.2 v127.94,19.6 | U3.6 23.17,26.68 U3.7 | U7.2 47.77,53.33 v47.77,52.78 | v101.27,15.16 101.27,10.71 102.54,9.44 102.54,8.81 103.18,8.17 | 103.18,8.17 103.18,8.81 104.45,9.44 107.62,12.62 112.7,11.98 112.7,13.83 POT1.1 | J2.SLEEVE 102.54,7.54 103.18,8.17
  Bottom 0.813: C16.2 26.74,37.62 v27.06,37.94 | C14.2 62.46,65.88 v61.27,64.69 | C13.2 44.6,52.14 v44.76,51.99
  other vias: 21.34,28.25 23.09,28.25 24.2,28.25 25.66,27.67 16.82,44.37 7.29,45.64
  pour Top (isolate 0.254): -0.33,76.75 144.45,76.12 144.45,-1.99 -0.33,-1.35
  pour Bottom (isolate 0.127): 28.17,25.95 26.5,25.95 24.83,27.62 23.56,27.62 23.56,26.27 22.61,26.27 22.61,27.7 21.66,27.7 20.63,26.59 19.36,26.59 19.36,25.16 19.12,24.92 18.56,24.44 17.06,24.36 17.06,28.41 21.18,28.41 21.66,28.89 24.6,28.89 25.07,28.41 28.17,28.41
  pour Bottom (isolate 0.3, rank 3): -0.96,3.73 39.68,3.73 39.68,31.67 29.52,31.67 30.15,75.48 -0.96,60.88
L2_BUMP  (via drill 0.6)
  Top 0.254: v25.71,60.11 25.71,55.8 v23.17,53.89
  Top 0.305: SW5.2 6.66,57.14 v6.66,53.89 | v104.45,41.19 v104.45,45.64 | v104.45,48.81 v94.92,48.81 | 101.27,38.65 101.27,38.4 v101.53,38.14
  Top 0.406: v97.46,38.65 101.27,38.65
  Bottom 0.305: v6.66,53.89 v23.17,53.89 | U1.38 87.94,33.57 95.56,33.57 95.56,36.75 v97.46,38.65 | v104.45,41.19 101.53,38.27 v101.53,38.14 | v104.45,45.64 v104.45,48.81 | v94.92,48.81 80.95,48.81 77.78,51.35 70.79,51.35 66.98,55.16 64.44,55.16 64.44,56.43 61.9,58.97 61.9,59.61 54.92,66.59 30.79,66.59 30.79,65.96 v25.71,60.11
LEFT  (via drill 0.5, 0.6)
  Top 0.406: v25.07,45.64 11.74,45.64 11.74,41.83 9.15,39.24 LEFT.2 | 43.49,40.71 v43.49,40.87 42.93,40.87 41.66,42.14 v34.12,42.14
  Bottom 0.406: v25.07,45.64 30.79,45.64 v34.12,42.14 | U1.13 57.46,39.76 56.19,41.03 43.65,41.03 v43.49,40.87
LEFT_BUMP  (via drill 0.6)
  Top 0.406: v58.73,60.88 v58.85,53.41 | U1.31 v80.32,46.91
  Bottom 0.406: SW1.2 14.07,60.45 14.79,59.22 26.55,59.18 32.06,65.96 53.65,65.96 v58.73,60.88 | v58.85,53.41 65.52,53.67 69.36,50.08 77.3,50.08 80.32,47.06 v80.32,46.91
N$1  (via drill 0.6)
  Top 0.406: U6.3 104.02,60.73 103.72,61.03 C11.1 102.67,62.02 102.22,62.46 100.95,62.46 100.8,62.62 100.8,64 R14.2 100.74,64.05 98.89,64.05 98.73,63.89 v98.73,63.26 | v107.31,54.84 107.31,54.83 R11.2
  Bottom 0.406: v107.31,54.84 104.76,54.84 104.29,55.32 104.29,61.67 103.5,62.46 99.53,62.46 v98.73,63.26
N$2  (via drill 0.6)
  Top 0.254: R16.2 111.43,46.91 116.51,41.83 116.51,34.84 120.32,31.03
  Top 0.406: v121.59,21.51 122.86,22.78 122.86,29.76 121.59,31.03 120.32,31.03 R8.2 | v114.45,12.77 111.91,12.77 106.99,17.7 C4.1
  Bottom 0.406: C8.1 121.91,21.51 v121.59,21.51 122.86,15 v114.45,12.77
N$3  (via drill 0.6)
  Top 0.406: CN1.VBUS 75.19,65.52 v75.5,65.84
  Bottom 0.406: v75.5,65.84 75.25,65.84
  Bottom 0.813: L1.2 75.25,65.84 v75.5,65.84
N$4
  Top 0.305: R2.2 78.02,62.54 76.51,64.05 76.51,66.97 77.14,67.48 77.14,68.93 74.35,68.93 74.35,64.98 CN1.D-
N$5
  Top 0.305: R3.2 79.94,69.44 73.59,69.44 CN1.D+
N$6
  Top 0.305: R2.1 76.51,60.88 U2.9
N$7
  Top 0.305: 77.44,57.11 77.39,57.11 U2.8
  Top 0.406: 77.44,57.11 R3.1
N$8
  Top 0.406: U4.4 112.76,23.35 113.97,22.14 113.97,19.53 POT1.2
N$9
  Top 0.406: U4.2 C4.2
N$10
  Top 0.305: U2.16 R4.2
N$11
  Top 0.406: U4.7 106.99,27.22 106.35,26.59 104.45,26.59 103.81,27.22 C5.1
N$12
  Bottom 0.406: U3.5 24.34,26.68 25.71,25.32 25.71,21.57 L4.2
N$13  (via drill 0.6)
  Top 0.305: D5.A 26.98,30.4 v29.52,27.86 | v27.87,22.78 33.33,22.78 33.96,23.41 33.96,23.31 D7.C
  Bottom 0.305: v29.52,27.86 29.52,27.22 28.88,26.59 28.88,23.41 v27.87,22.78
N$14  (via drill 0.6)
  Top 0.406: U4.5 111.37,28.55 v111.43,28.49
  Bottom 0.406: 125.67,27.75 SP1.1 | 116.41,28.49 C7.+
  Bottom 0.813: C7.+ 125.67,27.75 | v111.43,28.49 116.41,28.49
N$15  (via drill 0.6)
  Top 0.406: U4.8 105.72,30.4 v106.35,31.03
  Bottom 0.813: v106.35,31.03 110.8,31.03 112.07,29.76 126.83,29.76 127.62,28.97 127.62,24.84 126.99,24.2 SP1.2
N$16  (via drill 0.6)
  Top 0.406: v111.43,22.14 111.43,21.82 110.8,21.82 R6.1 108.26,21.82 U4.3
  Bottom 0.406: 109.04,14.66 109.21,14.84 | 109.21,14.84 110.16,15.79 110.16,20.87 v111.43,22.14 | J2.TSH 106.15,17.89 109.21,14.84
N$17
  Bottom 0.305: U$3.P$2 14.7,50.72 C20.1
  Bottom 0.406: IC1.1 14.7,40.82 C20.1
N$18
  Bottom 0.305: R19.1 16.18,34.21 15.8,35.86 14.86,36.11 IC1.7
N$19  (via drill 0.5)
  Top 0.406: 105.72,60.03 109.53,60.03 109.67,60.17 | U6.1 105.25,57.08 105.72,57.54 105.72,60.03 | 105.72,60.03 105.72,61.03 102.72,64.03 R14.1 | D3.1 110.31,60.81 109.67,60.17 | D3.3 112.21,63.03 v111.99,63.26 | v111.43,59.84 110,59.84 109.67,60.17
  Bottom 0.406: v111.99,63.26 111.99,60.4 v111.43,59.84
N$20
  Bottom 0.254: U3.2 22.76,31.83 22.29,32.3 22.29,33.26 R7.1 22.14,33.41 R9.2
N$21  (via drill 0.6)
  Top 0.406: v40.31,53.97 36.77,53.97 TFT1.10
  Bottom 0.406: R10.2 40.34,53.99 v40.31,53.97
N$22  (via drill 0.6)
  Top 0.406: v107.72,61.03 107.88,61.19 107.88,61.77 108.26,62.15 110.28,62.15 D3.4 | R13.1 104.86,54.49 v106.72,56.34
  Bottom 0.406: v107.72,61.03 107.72,57.34 v106.72,56.34
N$23
  Top 0.406: R12.1 113.72,60.73 113.26,61.19 D3.2
N$24
  Bottom 0.406: R10.1 45.81,54.28 U7.3 U7.4
N$25
  Top 0.406: U6.4 C12.1 98.69,59.01 R15.1
N$26
  Bottom 0.305: IC1.2 14.76,39.92 16.82,39.92 16.82,40.56 C19.1 18.51,42.46 20.63,42.46 20.63,50.72 U$3.P$1
N$28
  Bottom 0.406: IC1.27 9.2,42.31 9.2,45.64 8.83,45.64 C21.1
N$29  (via drill 0.6)
  Top 0.406: 106.35,10.71 v108.26,10.71 117.78,10.71 124.13,17.06 123.5,17.06 119.69,20.87 118.42,20.87 v117.78,21.51 | 106.35,10.71 v100,10.71 | R1.2 106.35,10.71
  Bottom 0.406: J2.RING 108.38,10.59 v108.26,10.71 | v100,10.71 100,12.01 J2.TIP | v117.78,21.51 117.78,23.52 C7.-
N$31  (via drill 0.6)
  Top 0.305: v20.63,36.11 25.6,36.11 D5.C
  Bottom 0.305: R20.2 v20.63,36.11
PWM0  (via drill 0.6)
  Top 0.305: 56.19,37.06 56.19,39.6
  Top 0.406: R8.1 110.8,31.03 100.64,40.56 v96.67,40.68 | U1.12 56.03,36.9 56.19,37.06 | 56.19,39.6 57.14,40.56 v60,40.68
  Bottom 0.406: v60,40.68 v96.67,40.68
PWR_EN
  Bottom 0.254: U3.1 21.3,30.78 20.84,31.24 | 20.84,31.24 R18.2 | 20.1,30.5 20.84,31.24
  Bottom 0.305: 20.1,30.5 18.83,30.5 15.55,27.22 15.55,20.87 14.91,20.87 13.9,20.24 14.15,17.06 14.15,14.65 14.91,13.89 15.55,13.89 16.82,12.62 19.99,12.62 19.99,15.05 D6.C | R19.2 18.94,31.88 18.72,31.67 19.57,31.67 R18.2
PWR_SW  (via drill 0.6)
  Top 0.305: v35.87,18.33 35.87,19.71 D7.A
  Bottom 0.305: 26.34,14.52 33.33,14.52 33.96,15.16 33.96,16.43 v35.87,18.33 | SW3.P$1 25.04,13.22 26.34,14.52 | 26.34,14.52 26.34,15.05 D6.A
PWR_SW_STATE  (via drill 0.6)
  Top 0.305: v75.24,39.79 v75.24,52.11 | v16.18,37.38 v16.18,41.83 | v21.9,60.24 21.9,58.34 22.53,57.7 22.53,56.43 20.63,54.53 19.36,54.53 v17.45,52.62
  Bottom 0.279: 15.55,41.83 15.55,48.81
  Bottom 0.305: IC1.6 14.83,36.75 16.18,36.75 R20.1 C22.2 16.31,37.51 v16.18,37.38 | U1.37 87.94,38.65 87.3,39.29 87.05,39.29 86.67,39.67 75.49,39.67 v75.24,39.79 | v75.24,52.11 71.43,51.99 67.62,55.8 65.08,55.8 65.08,57.07 62.54,59.61 62.54,60.24 55.55,67.23 30.15,67.23 29.52,65.96 29.52,65.32 24.44,60.24 v21.9,60.24 | v16.18,41.83 15.55,41.83 | 15.55,48.81 16.82,48.81 17.45,49.45 v17.45,52.62
R2_BUMP  (via drill 0.6)
  Top 0.406: SW4.2 119.05,57.66 v119.05,53.26 | v106.35,45.64 105.72,45.64 105.72,38.02 108.26,36.11 v108.26,35.48 | v103.18,34.84 93.02,34.84 93.02,33.57 85.4,33.57 U1.36
  Bottom 0.406: v119.05,53.26 106.99,53.26 106.99,48.81 106.35,48.81 v106.35,45.64 | v108.26,35.48 104.45,35.48 v103.18,34.84
RESET  (via drill 0.6)
  Top 0.305: v4.75,32.3 7.93,32.3 7.93,29.13 | 7.93,29.13 7.93,26.59 9.83,26.59 9.83,25.7 10.47,25.7 v10.47,24.68 | v10.72,29.13 7.93,29.13
  Bottom 0.305: IC1.24 4.75,40.82 v4.75,32.3 | v10.47,24.68 12.37,24.68 12.37,18.97 7.93,18.97 ISP1.5 | R17.1 11.04,29.45 v10.72,29.13
RIGHT  (via drill 0.6)
  Top 0.406: RIGHT.2 25.88,39.45 28.25,41.83 28.25,51.99 28.72,52.46 31.9,52.46 32.53,51.83 v32.53,51.03 | U1.15 60.11,38.29 62.86,41.03 62.86,45.32 59.2,48.97 v49.76,48.97
  Bottom 0.406: v32.53,51.03 33.88,51.03 34.91,50 48.73,50 v49.76,48.97
RIGHT_BUMP  (via drill 0.6)
  Top 0.406: v101.91,36.75 91.69,36.75 arc45 91.33,36.6 U1.40
  Bottom 0.406: SW2.2 125.73,56.97 arc-45 125.58,56.61 119.69,49.45 119.69,43.31 arc-45 119.54,42.95 113.34,36.75 v101.91,36.75
RXD  (via drill 0.5, 0.6)
  Top 0.305: 51.11,37.02 51.11,43.57 | U2.4 v73.64,47.39 v73.65,47.38
  Top 0.406: 73.65,57.99 U2.4 | 51.11,37.02 U1.8 | 51.11,43.57 53.25,43.57 v56.66,46.98
  Bottom 0.406: v73.65,47.38 73.63,47.37 60.3,47.37 59.76,46.83 56.82,46.83 v56.66,46.98
SELECT  (via drill 0.5)
  Top 0.305: 27.14,16.03 27.14,12.77 26.98,12.62
  Top 0.406: SEL.2 26.25,11.89 26.98,12.62 | 27.14,16.03 27.14,17.3 27.77,17.93 27.77,20.71 28.88,21.82 v34.52,21.82
  Bottom 0.406: U1.18 60.36,33.57 34.91,33.57 33.65,32.3 33.65,26.59 35.71,24.52 35.71,22.54 34.99,21.82 v34.52,21.82
START  (via drill 0.6)
  Top 0.406: START.2 25.25,19.78 25.71,20.24 25.71,22.78 26.98,24.05 v32.93,24.05
  Bottom 0.406: U1.16 58.46,34.21 34.6,34.21 33.01,32.62 33.01,24.68 32.93,24.6 v32.93,24.05
TFT_CS  (via drill 0.6)
  Top 0.305: 68.89,37.22 68.89,43.41
  Top 0.406: U1.24 70.16,35.95 68.89,37.22 | 68.89,43.41 v66.14,46.16 | TFT1.5 46.72,49.03 v49.72,46.03
  Bottom 0.406: v49.72,46.03 66.01,46.03 v66.14,46.16
TFT_DC
  Top 0.406: U1.5 47.3,46.45 45.72,48.03 TFT1.4
TFT_LED  (via drill 0.6)
  Top 0.406: U1.7 49.84,44.15 52.72,47.03 v52.72,47.71
  Bottom 0.406: v52.72,47.71 52.72,50.87 52.48,51.11 50.16,51.11 49.41,52.02 U7.1
TFT_MOSI
  Top 0.406: TFT1.6 59.72,50.03 65.08,44.67 U1.19
TFT_RESET
  Top 0.406: U1.3 44.76,44.99 43.72,46.03 TFT1.2
TFT_SCK  (via drill 0.6)
  Top 0.406: TFT1.3 44.72,47.03 45.72,46.03 45.72,45.52 v46.19,45.05 | v70.32,45.05 70.32,38.44 U1.23
  Bottom 0.406: v46.19,45.05 v70.32,45.05
TXD  (via drill 0.5)
  Top 0.254: U2.1 71.69,56.7
  Top 0.305: 53.65,37.22 53.65,39.84
  Top 0.406: 71.69,56.7 70.79,55.8 70.79,53.26 v66.74,49.21 | U1.10 52.38,35.95 53.65,37.22 | 53.65,39.84 58.57,44.76 v58.57,47.7
  Bottom 0.406: 66.43,48.89 v66.74,49.21 65.95,48.41 59.68,48.41 58.97,47.7 v58.57,47.7
UP  (via drill 0.6)
  Top 0.406: UP.2 18.55,47.37 v18.72,49.45 | v57.46,59.61 v57.2,52.49 | v77.78,46.91 U1.29
  Bottom 0.406: v18.72,49.45 18.72,51.99 19.36,52.62 27.61,52.62 33.33,64.69 52.38,64.69 v57.46,59.61 | v57.2,52.49 65.24,52.62 69.2,48.65 76.03,48.65 v77.78,46.91
USB_5V  (via drill 0.9)
  Top 0.813: C3.1 64.14,59.45 62.72,58.03 v62.72,56.03 63.72,56.03 64.72,55.16 68.56,55.16 Q1.3
  Top 1.422: D1.1 v30.79,49.03 v30.79,50.72 | v61.11,56.03 v62.72,56.03
  Bottom 1.422: v30.79,50.72 30.79,53.1 33.72,56.03 v62.72,56.03
V_BAT  (via drill 0.5, 0.6)
  Top 0.457: 96.42,52.53 v84.45,41.83 | v39.52,40.24 39.52,37.06 38.73,36.27 33.96,36.27 32.22,34.52 32.22,27.36 v31.5,26.65
  Top 0.508: R15.2 96.42,52.53
  Top 0.813: BT1.BT+1 BT1.BT+2
  Top 1.016: 30.79,19.34 BT1.BT+1
  Bottom 0.406: 32.53,21.98 D2.1
  Bottom 0.457: 41.11,41.83 v39.52,40.24 | v31.5,26.65 31.5,23.17 D2.1
  Bottom 0.508: v84.45,41.83 41.11,41.83
  Bottom 1.27: 31.04,16.58 BT1.BT+2 | D2.1 32.69,20.61 BT1.BT+1

### Text on the board
tPlace: By Matthew C. 2017 | With Love To / Michael Carlson / Taylor Lewis / Carson Bunker | GND | VCC | TX | RX | MISO | VCC | SCK | MOSI | RESET